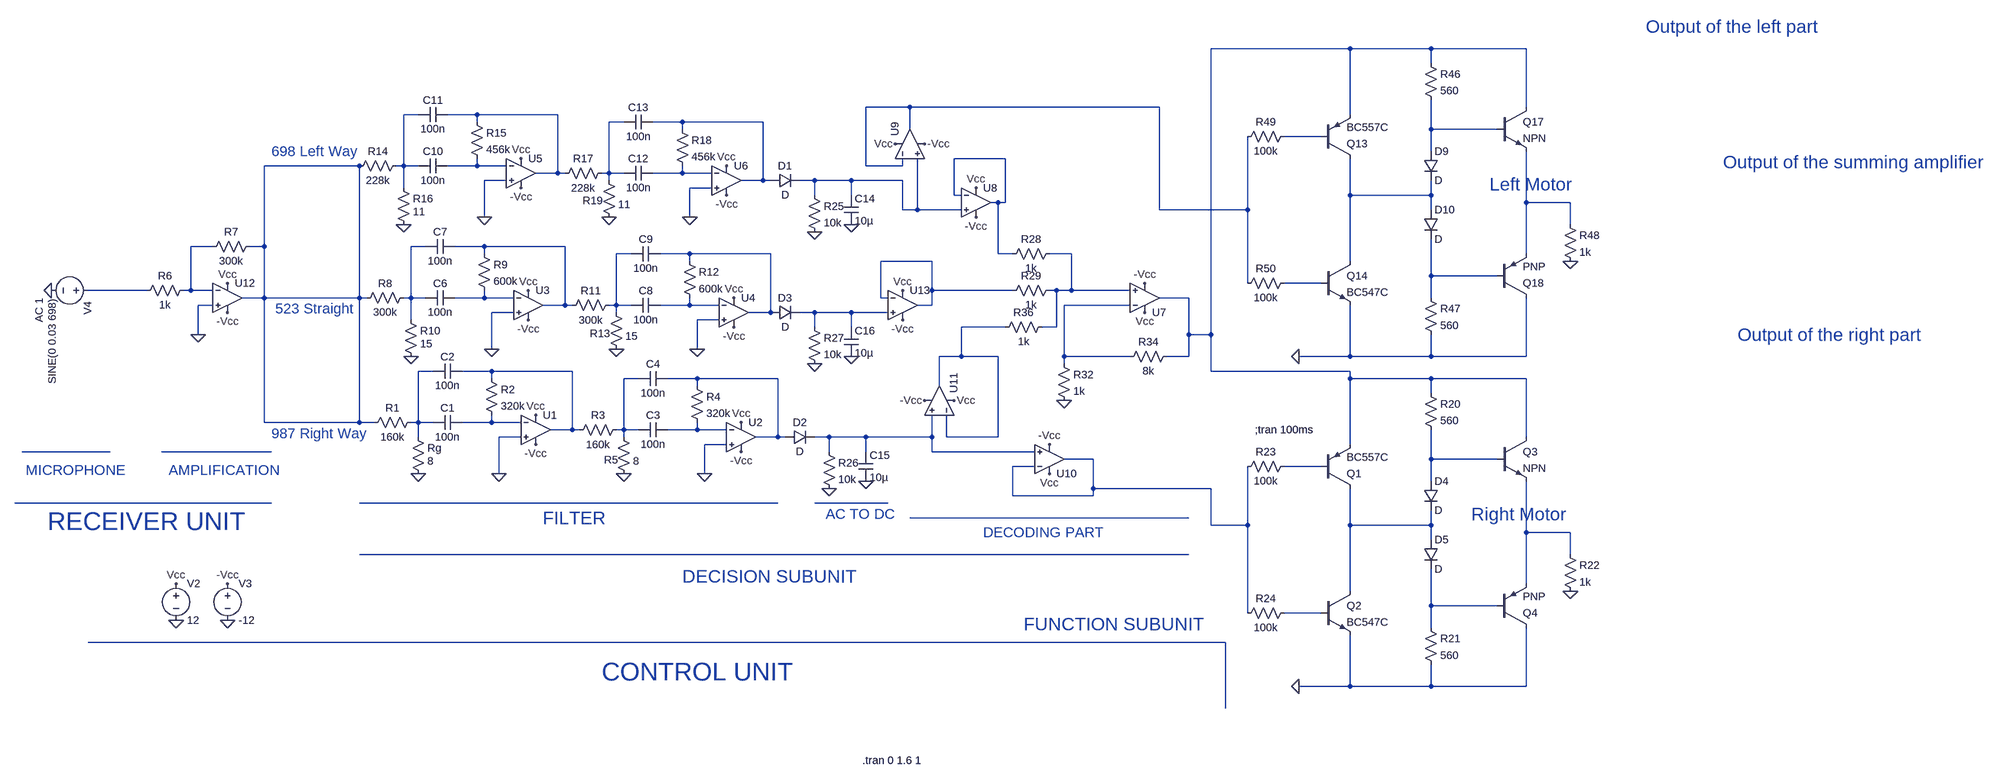
[diagram p0: schematic This-is-the-one.asc]
This-is-the-one.asc, the LTspice schematic file:
Version 4
SHEET 1 4472 1424
WIRE 704 -2160 400 -2160
WIRE 880 -2160 704 -2160
WIRE 1088 -2160 880 -2160
WIRE 880 -2128 880 -2160
WIRE -256 -2032 -352 -2032
WIRE 288 -2032 -256 -2032
WIRE 1088 -2032 1088 -2160
WIRE -1328 -2016 -1360 -2016
WIRE -1200 -2016 -1264 -2016
WIRE -1024 -2016 -1200 -2016
WIRE 704 -2016 704 -2160
WIRE -1200 -2000 -1200 -2016
WIRE -880 -2000 -912 -2000
WIRE -752 -2000 -816 -2000
WIRE -576 -2000 -752 -2000
WIRE -752 -1984 -752 -2000
WIRE -256 -1984 -256 -2032
WIRE 880 -1984 880 -2048
WIRE 1024 -1984 880 -1984
WIRE 640 -1968 560 -1968
WIRE 880 -1936 880 -1984
WIRE -48 -1920 -160 -1920
WIRE -1456 -1904 -1664 -1904
WIRE -1360 -1904 -1360 -2016
WIRE -1360 -1904 -1376 -1904
WIRE -1328 -1904 -1360 -1904
WIRE -1200 -1904 -1200 -1920
WIRE -1200 -1904 -1264 -1904
WIRE -1136 -1904 -1200 -1904
WIRE -352 -1904 -352 -2032
WIRE -272 -1904 -272 -1920
WIRE -272 -1904 -352 -1904
WIRE -1024 -1888 -1024 -2016
WIRE -1024 -1888 -1072 -1888
WIRE -1008 -1888 -1024 -1888
WIRE -912 -1888 -912 -2000
WIRE -912 -1888 -928 -1888
WIRE -880 -1888 -912 -1888
WIRE -752 -1888 -752 -1904
WIRE -752 -1888 -816 -1888
WIRE -688 -1888 -752 -1888
WIRE -1136 -1872 -1184 -1872
WIRE -912 -1872 -912 -1888
WIRE -576 -1872 -576 -2000
WIRE -576 -1872 -624 -1872
WIRE -560 -1872 -576 -1872
WIRE -464 -1872 -496 -1872
WIRE -384 -1872 -464 -1872
WIRE -272 -1872 -384 -1872
WIRE -1360 -1856 -1360 -1904
WIRE -688 -1856 -736 -1856
WIRE -464 -1840 -464 -1872
WIRE -384 -1840 -384 -1872
WIRE -160 -1840 -160 -1920
WIRE -144 -1840 -160 -1840
WIRE 704 -1840 704 -1920
WIRE 880 -1840 880 -1872
WIRE 880 -1840 704 -1840
WIRE -64 -1824 -80 -1824
WIRE -48 -1824 -48 -1920
WIRE -48 -1824 -64 -1824
WIRE 1088 -1824 1088 -1936
WIRE 1184 -1824 1088 -1824
WIRE -272 -1808 -272 -1872
WIRE -240 -1808 -240 -1920
WIRE -240 -1808 -272 -1808
WIRE -144 -1808 -240 -1808
WIRE 288 -1808 288 -2032
WIRE 480 -1808 480 -1968
WIRE 480 -1808 288 -1808
WIRE 880 -1808 880 -1840
WIRE -1184 -1792 -1184 -1872
WIRE -736 -1792 -736 -1856
WIRE 1184 -1776 1184 -1824
WIRE -1776 -1728 -1824 -1728
WIRE -1664 -1728 -1664 -1904
WIRE -1664 -1728 -1696 -1728
WIRE -1312 -1728 -1344 -1728
WIRE -1184 -1728 -1248 -1728
WIRE -1008 -1728 -1184 -1728
WIRE -1184 -1712 -1184 -1728
WIRE -864 -1712 -896 -1712
WIRE -736 -1712 -800 -1712
WIRE -560 -1712 -736 -1712
WIRE -64 -1712 -64 -1824
WIRE -32 -1712 -64 -1712
WIRE 96 -1712 48 -1712
WIRE 1088 -1712 1088 -1824
WIRE -736 -1696 -736 -1712
WIRE -208 -1696 -320 -1696
WIRE 704 -1696 704 -1840
WIRE 880 -1664 880 -1744
WIRE 1024 -1664 880 -1664
WIRE 480 -1648 480 -1808
WIRE 640 -1648 560 -1648
WIRE -1920 -1632 -2048 -1632
WIRE -1824 -1632 -1824 -1728
WIRE -1824 -1632 -1840 -1632
WIRE -1776 -1632 -1824 -1632
WIRE -208 -1632 -208 -1696
WIRE -32 -1632 -208 -1632
WIRE 64 -1632 48 -1632
WIRE 96 -1632 96 -1712
WIRE 96 -1632 64 -1632
WIRE 224 -1632 96 -1632
WIRE -1664 -1616 -1664 -1728
WIRE -1664 -1616 -1712 -1616
WIRE -1456 -1616 -1456 -1904
WIRE -1456 -1616 -1664 -1616
WIRE -1440 -1616 -1456 -1616
WIRE -1344 -1616 -1344 -1728
WIRE -1344 -1616 -1360 -1616
WIRE -1312 -1616 -1344 -1616
WIRE -1184 -1616 -1184 -1632
WIRE -1184 -1616 -1248 -1616
WIRE -1120 -1616 -1184 -1616
WIRE -320 -1616 -320 -1696
WIRE -304 -1616 -320 -1616
WIRE 352 -1616 288 -1616
WIRE 880 -1616 880 -1664
WIRE -1776 -1600 -1808 -1600
WIRE -1008 -1600 -1008 -1728
WIRE -1008 -1600 -1056 -1600
WIRE -992 -1600 -1008 -1600
WIRE -896 -1600 -896 -1712
WIRE -896 -1600 -912 -1600
WIRE -864 -1600 -896 -1600
WIRE -736 -1600 -736 -1616
WIRE -736 -1600 -800 -1600
WIRE -672 -1600 -736 -1600
WIRE -208 -1600 -208 -1632
WIRE -208 -1600 -240 -1600
WIRE 224 -1600 80 -1600
WIRE -1120 -1584 -1168 -1584
WIRE -896 -1584 -896 -1600
WIRE -560 -1584 -560 -1712
WIRE -560 -1584 -608 -1584
WIRE -544 -1584 -560 -1584
WIRE -464 -1584 -496 -1584
WIRE -384 -1584 -464 -1584
WIRE -304 -1584 -384 -1584
WIRE -1344 -1568 -1344 -1616
WIRE -672 -1568 -720 -1568
WIRE -464 -1552 -464 -1584
WIRE -384 -1552 -384 -1584
WIRE -48 -1552 -144 -1552
WIRE 64 -1552 64 -1632
WIRE 64 -1552 32 -1552
WIRE -1808 -1536 -1808 -1600
WIRE 352 -1536 352 -1616
WIRE 400 -1536 400 -2160
WIRE 400 -1536 352 -1536
WIRE -1168 -1504 -1168 -1584
WIRE -720 -1504 -720 -1568
WIRE -144 -1488 -144 -1552
WIRE -144 -1488 -192 -1488
WIRE -64 -1488 -144 -1488
WIRE 80 -1488 80 -1600
WIRE 224 -1488 80 -1488
WIRE 352 -1488 352 -1536
WIRE 352 -1488 304 -1488
WIRE 704 -1488 704 -1600
WIRE 704 -1488 592 -1488
WIRE 880 -1488 880 -1536
WIRE 880 -1488 704 -1488
WIRE 1088 -1488 1088 -1616
WIRE 1088 -1488 880 -1488
WIRE 80 -1472 80 -1488
WIRE -1296 -1456 -1328 -1456
WIRE -1168 -1456 -1232 -1456
WIRE -992 -1456 -1168 -1456
WIRE 400 -1456 400 -1536
WIRE 704 -1456 400 -1456
WIRE -1168 -1440 -1168 -1456
WIRE -848 -1440 -880 -1440
WIRE -720 -1440 -784 -1440
WIRE -544 -1440 -720 -1440
WIRE 704 -1440 704 -1456
WIRE 880 -1440 704 -1440
WIRE 1088 -1440 880 -1440
WIRE -720 -1424 -720 -1440
WIRE -192 -1424 -192 -1488
WIRE 880 -1408 880 -1440
WIRE -1664 -1344 -1664 -1616
WIRE -1456 -1344 -1456 -1616
WIRE -1456 -1344 -1664 -1344
WIRE -1424 -1344 -1456 -1344
WIRE -1328 -1344 -1328 -1456
WIRE -1328 -1344 -1344 -1344
WIRE -1296 -1344 -1328 -1344
WIRE -1168 -1344 -1168 -1360
WIRE -1168 -1344 -1232 -1344
WIRE -1104 -1344 -1168 -1344
WIRE -992 -1328 -992 -1456
WIRE -992 -1328 -1040 -1328
WIRE -976 -1328 -992 -1328
WIRE -880 -1328 -880 -1440
WIRE -880 -1328 -896 -1328
WIRE -848 -1328 -880 -1328
WIRE -720 -1328 -720 -1344
WIRE -720 -1328 -784 -1328
WIRE -656 -1328 -720 -1328
WIRE -1328 -1312 -1328 -1344
WIRE -1104 -1312 -1152 -1312
WIRE -880 -1312 -880 -1328
WIRE -544 -1312 -544 -1440
WIRE -544 -1312 -592 -1312
WIRE -528 -1312 -544 -1312
WIRE -432 -1312 -464 -1312
WIRE -352 -1312 -432 -1312
WIRE -208 -1312 -208 -1360
WIRE -208 -1312 -352 -1312
WIRE -176 -1312 -176 -1360
WIRE -64 -1312 -64 -1488
WIRE -64 -1312 -176 -1312
WIRE 1088 -1312 1088 -1440
WIRE -656 -1296 -704 -1296
WIRE 704 -1296 704 -1440
WIRE -2000 -1280 -2192 -1280
WIRE -1648 -1280 -1888 -1280
WIRE -432 -1280 -432 -1312
WIRE -352 -1280 -352 -1312
WIRE -208 -1280 -208 -1312
WIRE 16 -1280 -208 -1280
WIRE 144 -1264 80 -1264
WIRE 880 -1264 880 -1328
WIRE 1024 -1264 880 -1264
WIRE 16 -1248 -32 -1248
WIRE 640 -1248 560 -1248
WIRE -1152 -1232 -1152 -1312
WIRE -704 -1232 -704 -1296
WIRE 880 -1216 880 -1264
WIRE 144 -1200 144 -1264
WIRE 400 -1200 144 -1200
WIRE -32 -1184 -32 -1248
WIRE 144 -1184 144 -1200
WIRE 144 -1184 -32 -1184
WIRE -1648 -1168 -2208 -1168
WIRE -544 -1168 -1456 -1168
WIRE -304 -1168 -464 -1168
WIRE 352 -1136 -256 -1136
WIRE 400 -1120 400 -1200
WIRE 480 -1120 480 -1248
WIRE 480 -1120 400 -1120
WIRE 704 -1120 704 -1200
WIRE 880 -1120 880 -1152
WIRE 880 -1120 704 -1120
WIRE 1088 -1104 1088 -1216
WIRE 1184 -1104 1088 -1104
WIRE 880 -1088 880 -1120
WIRE 352 -1056 -1456 -1056
WIRE 1184 -1056 1184 -1104
WIRE 1088 -992 1088 -1104
WIRE 704 -976 704 -1120
WIRE 880 -944 880 -1024
WIRE 1024 -944 880 -944
WIRE 480 -928 480 -1120
WIRE 640 -928 560 -928
WIRE 880 -896 880 -944
WIRE 432 -864 -2048 -864
WIRE 704 -768 704 -880
WIRE 704 -768 592 -768
WIRE 880 -768 880 -816
WIRE 880 -768 704 -768
WIRE 1088 -768 1088 -896
WIRE 1088 -768 880 -768
WIRE 432 -720 432 -864
FLAG -1328 -1232 0
FLAG -2128 -1632 0
FLAG -1072 -1296 -Vcc
FLAG -1152 -1232 0
FLAG -880 -1232 0
FLAG -624 -1344 Vcc
FLAG -624 -1280 -Vcc
FLAG -704 -1232 0
FLAG -1344 -1488 0
FLAG -1088 -1632 Vcc
FLAG -1088 -1568 -Vcc
FLAG -1168 -1504 0
FLAG -896 -1504 0
FLAG -640 -1616 Vcc
FLAG -640 -1552 -Vcc
FLAG -720 -1504 0
FLAG -1360 -1776 0
FLAG -1104 -1920 Vcc
FLAG -1104 -1856 -Vcc
FLAG -1184 -1792 0
FLAG -912 -1792 0
FLAG -656 -1904 Vcc
FLAG -656 -1840 -Vcc
FLAG -736 -1792 0
FLAG -464 -1472 0
FLAG -384 -1488 0
FLAG -352 -1216 0
FLAG -432 -1200 0
FLAG -464 -1760 0
FLAG -384 -1776 0
FLAG -1808 -1536 0
FLAG -1744 -1584 -Vcc
FLAG -1072 -1360 Vcc
FLAG -1744 -1648 Vcc
FLAG -1856 -992 Vcc
FLAG -1744 -992 -Vcc
FLAG -1856 -912 0
FLAG -1744 -912 0
FLAG 1184 -1696 0
FLAG 1184 -976 0
FLAG 592 -1488 0
FLAG 592 -768 0
FLAG 256 -1584 Vcc
FLAG 256 -1648 -Vcc
FLAG -288 -1952 Vcc
FLAG -224 -1952 -Vcc
FLAG 48 -1232 Vcc
FLAG 48 -1296 -Vcc
FLAG 80 -1392 0
FLAG -112 -1856 Vcc
FLAG -112 -1792 -Vcc
FLAG -160 -1392 Vcc
FLAG -224 -1392 -Vcc
FLAG -272 -1632 Vcc
FLAG -272 -1568 -Vcc
SYMBOL res -1328 -1360 R90
WINDOW 0 0 56 VBottom 2
WINDOW 3 32 56 VTop 2
SYMATTR InstName R1
SYMATTR Value 160k
SYMBOL cap -1232 -1360 R90
WINDOW 0 0 32 VBottom 2
WINDOW 3 32 32 VTop 2
SYMATTR InstName C1
SYMATTR Value 100n
SYMBOL cap -1232 -1472 R90
WINDOW 0 0 32 VBottom 2
WINDOW 3 32 32 VTop 2
SYMATTR InstName C2
SYMATTR Value 100n
SYMBOL res -1184 -1456 R0
SYMATTR InstName R2
SYMATTR Value 320k
SYMBOL Opamps\\UniversalOpamp2 -1072 -1328 R0
SYMATTR InstName U1
SYMBOL res -1344 -1328 R0
WINDOW 3 36 68 Left 2
SYMATTR Value 8
SYMATTR InstName Rg
SYMBOL res -880 -1344 R90
WINDOW 0 0 56 VBottom 2
WINDOW 3 33 56 VTop 2
SYMATTR InstName R3
SYMATTR Value 160k
SYMBOL cap -784 -1344 R90
WINDOW 0 0 32 VBottom 2
WINDOW 3 32 32 VTop 2
SYMATTR InstName C3
SYMATTR Value 100n
SYMBOL cap -784 -1456 R90
WINDOW 0 0 32 VBottom 2
WINDOW 3 32 32 VTop 2
SYMATTR InstName C4
SYMATTR Value 100n
SYMBOL res -736 -1440 R0
SYMATTR InstName R4
SYMATTR Value 320k
SYMBOL Opamps\\UniversalOpamp2 -624 -1312 R0
SYMATTR InstName U2
SYMBOL res -896 -1328 R0
WINDOW 3 36 68 Left 2
WINDOW 0 -27 66 Left 2
SYMATTR Value 8
SYMATTR InstName R5
SYMBOL voltage -2032 -1632 R90
WINDOW 3 17 94 Left 2
WINDOW 123 17 122 Left 2
WINDOW 39 0 0 Left 2
SYMATTR Value SINE(0 0.03 698)
SYMATTR Value2 AC 1
SYMATTR InstName V4
SYMBOL res -1344 -1632 R90
WINDOW 0 0 56 VBottom 2
WINDOW 3 32 56 VTop 2
SYMATTR InstName R8
SYMATTR Value 300k
SYMBOL cap -1248 -1632 R90
WINDOW 0 0 32 VBottom 2
WINDOW 3 32 32 VTop 2
SYMATTR InstName C6
SYMATTR Value 100n
SYMBOL cap -1248 -1744 R90
WINDOW 0 0 32 VBottom 2
WINDOW 3 32 32 VTop 2
SYMATTR InstName C7
SYMATTR Value 100n
SYMBOL res -1200 -1728 R0
SYMATTR InstName R9
SYMATTR Value 600k
SYMBOL Opamps\\UniversalOpamp2 -1088 -1600 R0
SYMATTR InstName U3
SYMBOL res -1360 -1584 R0
WINDOW 3 36 68 Left 2
SYMATTR Value 15
SYMATTR InstName R10
SYMBOL res -896 -1616 R90
WINDOW 0 0 56 VBottom 2
WINDOW 3 33 56 VTop 2
SYMATTR InstName R11
SYMATTR Value 300k
SYMBOL cap -800 -1616 R90
WINDOW 0 0 32 VBottom 2
WINDOW 3 32 32 VTop 2
SYMATTR InstName C8
SYMATTR Value 100n
SYMBOL cap -800 -1728 R90
WINDOW 0 0 32 VBottom 2
WINDOW 3 32 32 VTop 2
SYMATTR InstName C9
SYMATTR Value 100n
SYMBOL res -752 -1712 R0
SYMATTR InstName R12
SYMATTR Value 600k
SYMBOL Opamps\\UniversalOpamp2 -640 -1584 R0
SYMATTR InstName U4
SYMBOL res -912 -1600 R0
WINDOW 3 36 68 Left 2
WINDOW 0 -42 62 Left 2
SYMATTR Value 15
SYMATTR InstName R13
SYMBOL res -1360 -1920 R90
WINDOW 0 0 56 VBottom 2
WINDOW 3 32 56 VTop 2
SYMATTR InstName R14
SYMATTR Value 228k
SYMBOL cap -1264 -1920 R90
WINDOW 0 0 32 VBottom 2
WINDOW 3 32 32 VTop 2
SYMATTR InstName C10
SYMATTR Value 100n
SYMBOL cap -1264 -2032 R90
WINDOW 0 0 32 VBottom 2
WINDOW 3 32 32 VTop 2
SYMATTR InstName C11
SYMATTR Value 100n
SYMBOL res -1216 -2016 R0
SYMATTR InstName R15
SYMATTR Value 456k
SYMBOL Opamps\\UniversalOpamp2 -1104 -1888 R0
SYMATTR InstName U5
SYMBOL res -1376 -1872 R0
WINDOW 3 36 68 Left 2
SYMATTR Value 11
SYMATTR InstName R16
SYMBOL res -912 -1904 R90
WINDOW 0 0 56 VBottom 2
WINDOW 3 33 56 VTop 2
SYMATTR InstName R17
SYMATTR Value 228k
SYMBOL cap -816 -1904 R90
WINDOW 0 0 32 VBottom 2
WINDOW 3 32 32 VTop 2
SYMATTR InstName C12
SYMATTR Value 100n
SYMBOL cap -816 -2016 R90
WINDOW 0 0 32 VBottom 2
WINDOW 3 32 32 VTop 2
SYMATTR InstName C13
SYMATTR Value 100n
SYMBOL res -768 -2000 R0
SYMATTR InstName R18
SYMATTR Value 456k
SYMBOL Opamps\\UniversalOpamp2 -656 -1872 R0
SYMATTR InstName U6
SYMBOL res -928 -1888 R0
WINDOW 3 36 68 Left 2
WINDOW 0 -42 60 Left 2
SYMATTR Value 11
SYMATTR InstName R19
SYMBOL diode -560 -1856 R270
WINDOW 0 32 32 VTop 2
WINDOW 3 0 32 VBottom 2
SYMATTR InstName D1
SYMBOL diode -528 -1296 R270
WINDOW 0 32 32 VTop 2
WINDOW 3 0 32 VBottom 2
SYMATTR InstName D2
SYMBOL diode -560 -1568 R270
WINDOW 0 32 32 VTop 2
WINDOW 3 0 32 VBottom 2
SYMATTR InstName D3
SYMBOL res -480 -1856 R0
SYMATTR InstName R25
SYMATTR Value 10k
SYMBOL res -448 -1296 R0
SYMATTR InstName R26
SYMATTR Value 10k
SYMBOL res -480 -1568 R0
SYMATTR InstName R27
SYMATTR Value 10k
SYMBOL cap -400 -1840 R0
SYMATTR InstName C14
SYMATTR Value 10µ
SYMBOL cap -368 -1280 R0
SYMATTR InstName C15
SYMATTR Value 10µ
SYMBOL cap -400 -1552 R0
SYMATTR InstName C16
SYMATTR Value 10µ
SYMBOL Opamps\\UniversalOpamp2 -1744 -1616 R0
SYMATTR InstName U12
SYMBOL res -1824 -1648 R90
WINDOW 0 0 56 VBottom 2
WINDOW 3 32 56 VTop 2
SYMATTR InstName R6
SYMATTR Value 1k
SYMBOL res -1680 -1744 R90
WINDOW 0 0 56 VBottom 2
WINDOW 3 32 56 VTop 2
SYMATTR InstName R7
SYMATTR Value 300k
SYMBOL voltage -1856 -1008 R0
WINDOW 123 0 0 Left 2
WINDOW 39 0 0 Left 2
SYMATTR InstName V2
SYMATTR Value 12
SYMBOL voltage -1744 -1008 R0
WINDOW 123 0 0 Left 2
WINDOW 39 0 0 Left 2
SYMATTR InstName V3
SYMATTR Value -12
SYMBOL pnp 640 -1920 M180
SYMATTR InstName Q13
SYMATTR Value BC557C
SYMBOL npn 640 -1696 R0
SYMATTR InstName Q14
SYMATTR Value BC547C
SYMBOL npn 1024 -2032 R0
SYMATTR InstName Q17
SYMBOL pnp 1024 -1616 M180
SYMATTR InstName Q18
SYMBOL res 864 -2144 R0
SYMATTR InstName R46
SYMATTR Value 560
SYMBOL res 864 -1632 R0
SYMATTR InstName R47
SYMATTR Value 560
SYMBOL diode 864 -1936 R0
SYMATTR InstName D9
SYMBOL diode 864 -1808 R0
SYMATTR InstName D10
SYMBOL res 1168 -1792 R0
SYMATTR InstName R48
SYMATTR Value 1k
SYMBOL res 576 -1984 R90
WINDOW 0 0 56 VBottom 2
WINDOW 3 32 56 VTop 2
SYMATTR InstName R49
SYMATTR Value 100k
SYMBOL res 576 -1664 R90
WINDOW 0 0 56 VBottom 2
WINDOW 3 32 56 VTop 2
SYMATTR InstName R50
SYMATTR Value 100k
SYMBOL pnp 640 -1200 M180
SYMATTR InstName Q1
SYMATTR Value BC557C
SYMBOL npn 640 -976 R0
SYMATTR InstName Q2
SYMATTR Value BC547C
SYMBOL npn 1024 -1312 R0
SYMATTR InstName Q3
SYMBOL pnp 1024 -896 M180
SYMATTR InstName Q4
SYMBOL res 864 -1424 R0
SYMATTR InstName R20
SYMATTR Value 560
SYMBOL res 864 -912 R0
SYMATTR InstName R21
SYMATTR Value 560
SYMBOL diode 864 -1216 R0
SYMATTR InstName D4
SYMBOL diode 864 -1088 R0
SYMATTR InstName D5
SYMBOL res 1168 -1072 R0
SYMATTR InstName R22
SYMATTR Value 1k
SYMBOL res 576 -1264 R90
WINDOW 0 0 56 VBottom 2
WINDOW 3 32 56 VTop 2
SYMATTR InstName R23
SYMATTR Value 100k
SYMBOL res 576 -944 R90
WINDOW 0 0 56 VBottom 2
WINDOW 3 32 56 VTop 2
SYMATTR InstName R24
SYMATTR Value 100k
SYMBOL Opamps\\UniversalOpamp2 256 -1616 M180
SYMATTR InstName U7
SYMBOL res 64 -1728 R90
WINDOW 0 0 56 VBottom 2
WINDOW 3 32 56 VTop 2
SYMATTR InstName R28
SYMATTR Value 1k
SYMBOL res 64 -1648 R90
WINDOW 0 0 56 VBottom 2
WINDOW 3 32 56 VTop 2
SYMATTR InstName R29
SYMATTR Value 1k
SYMBOL Opamps\\UniversalOpamp2 -256 -1952 R270
SYMATTR InstName U9
SYMBOL Opamps\\UniversalOpamp2 48 -1264 M180
SYMATTR InstName U10
SYMBOL res 64 -1488 R0
SYMATTR InstName R32
SYMATTR Value 1k
SYMBOL res 320 -1504 R90
WINDOW 0 0 56 VBottom 2
WINDOW 3 32 56 VTop 2
SYMATTR InstName R34
SYMATTR Value 8k
SYMBOL res 48 -1568 R90
WINDOW 0 0 56 VBottom 2
WINDOW 3 32 56 VTop 2
SYMATTR InstName R36
SYMATTR Value 1k
SYMBOL Opamps\\UniversalOpamp2 -112 -1824 R0
SYMATTR InstName U8
SYMBOL Opamps\\UniversalOpamp2 -192 -1392 M270
SYMATTR InstName U11
SYMBOL Opamps\\UniversalOpamp2 -272 -1600 R0
SYMATTR InstName U13
TEXT -1648 -1936 Left 3 ;698 Left Way
TEXT -1640 -1592 Left 3 ;523 Straight
TEXT -1648 -1320 Left 3 ;987 Right Way
TEXT -360 552 Left 2 !.tran 0 1.6 1
TEXT 496 -1328 Left 2 !;tran 100ms
TEXT 1008 -1864 Left 4 ;Left Motor
TEXT 968 -1144 Left 4 ;Right Motor
TEXT 2384 -2208 Left 4 ;Output of the left part
TEXT 2552 -1912 Left 4 ;Output of the summing amplifier
TEXT 2584 -1536 Left 4 ;Output of the right part
TEXT -1056 -1136 Left 4 ;FILTER
TEXT -1872 -1240 Left 3 ;AMPLIFICATION
TEXT -2184 -1240 Left 3 ;MICROPHONE
TEXT -2136 -1128 Left 5 ;RECEIVER UNIT
TEXT -440 -1144 Left 3 ;AC TO DC
TEXT -96 -1104 Left 3 ;DECODING PART
TEXT -752 -1008 Left 4 ;DECISION SUBUNIT
TEXT -8 -904 Left 4 ;FUNCTION SUBUNIT
TEXT -928 -800 Left 5 ;CONTROL UNIT

The netlist it stands for:
* This-is-the-one.asc
R1 N031 N010 160k
C1 N035 N031 100n
C2 N032 N031 100n
R2 N032 N035 320k
XU1 0 N035 Vcc -Vcc N032 level.2 Avol=1Meg GBW=10Meg Slew=10Meg ilimit=25m rail=0 Vos=0 phimargin=45 en=0 enk=0 in=0 ink=0 Rin=500Meg  ; pins IN+ IN- V+ V- OUT
Rg N031 0 8
R3 N033 N032 160k
C3 N036 N033 100n
C4 N034 N033 100n
R4 N034 N036 320k
XU2 0 N036 Vcc -Vcc N034 level.2 Avol=1Meg GBW=10Meg Slew=10Meg ilimit=25m rail=0 Vos=0 phimargin=45 en=0 enk=0 in=0 ink=0 Rin=500Meg  ; pins IN+ IN- V+ V- OUT
R5 N033 0 8
V4 N025 0 SINE(0 0.03 698) AC 1
R8 N017 N010 300k
C6 N026 N017 100n
C7 N018 N017 100n
R9 N018 N026 600k
XU3 0 N026 Vcc -Vcc N018 level.2 Avol=1Meg GBW=10Meg Slew=10Meg ilimit=25m rail=0 Vos=0 phimargin=45 en=0 enk=0 in=0 ink=0 Rin=500Meg  ; pins IN+ IN- V+ V- OUT
R10 N017 0 15
R11 N019 N018 300k
C8 N027 N019 100n
C9 N020 N019 100n
R12 N020 N027 600k
XU4 0 N027 Vcc -Vcc N020 level.2 Avol=1Meg GBW=10Meg Slew=10Meg ilimit=25m rail=0 Vos=0 phimargin=45 en=0 enk=0 in=0 ink=0 Rin=500Meg  ; pins IN+ IN- V+ V- OUT
R13 N019 0 15
R14 N003 N010 228k
C10 N011 N003 100n
C11 N004 N003 100n
R15 N004 N011 456k
XU5 0 N011 Vcc -Vcc N004 level.2 Avol=1Meg GBW=10Meg Slew=10Meg ilimit=25m rail=0 Vos=0 phimargin=45 en=0 enk=0 in=0 ink=0 Rin=500Meg  ; pins IN+ IN- V+ V- OUT
R16 N003 0 11
R17 N005 N004 228k
C12 N012 N005 100n
C13 N006 N005 100n
R18 N006 N012 456k
XU6 0 N012 Vcc -Vcc N006 level.2 Avol=1Meg GBW=10Meg Slew=10Meg ilimit=25m rail=0 Vos=0 phimargin=45 en=0 enk=0 in=0 ink=0 Rin=500Meg  ; pins IN+ IN- V+ V- OUT
R19 N005 0 11
D1 N006 N013 D
D2 N034 N037 D
D3 N020 N029 D
R25 N013 0 10k
R26 N037 0 10k
R27 N029 0 10k
C14 N013 0 10µ
C15 N037 0 10µ
C16 N029 0 10µ
XU12 0 N016 Vcc -Vcc N010 level.2 Avol=1Meg GBW=10Meg Slew=10Meg ilimit=25m rail=0 Vos=0 phimargin=45 en=0 enk=0 in=0 ink=0 Rin=500Meg  ; pins IN+ IN- V+ V- OUT
R6 N016 N025 1k
R7 N010 N016 300k
V2 Vcc 0 12
V3 -Vcc 0 -12
Q13 N014 N008 N001 0 BC557C
Q14 N014 N024 0 0 BC547C
Q17 N001 N007 N015 0 NPN
Q18 0 N023 N015 0 PNP
R46 N001 N007 560
R47 N023 0 560
D9 N007 N014 D
D10 N014 N023 D
R48 N015 0 1k
R49 N008 N002 100k
R50 N024 N002 100k
Q1 N047 N042 N001 0 BC557C
Q2 N047 N051 0 0 BC547C
Q3 N001 N041 N048 0 NPN
Q4 0 N050 N048 0 PNP
R20 N001 N041 560
R21 N050 0 560
D4 N041 N047 D
D5 N047 N050 D
R22 N048 0 1k
R23 N042 N040 100k
R24 N051 N040 100k
XU7 N021 N028 Vcc -Vcc N001 level.2 Avol=1Meg GBW=10Meg Slew=10Meg ilimit=25m rail=0 Vos=0 phimargin=45 en=0 enk=0 in=0 ink=0 Rin=500Meg  ; pins IN+ IN- V+ V- OUT
R28 N021 N009 1k
R29 N021 N022 1k
XU9 N013 N002 Vcc -Vcc N002 level.2 Avol=1Meg GBW=10Meg Slew=10Meg ilimit=25m rail=0 Vos=0 phimargin=45 en=0 enk=0 in=0 ink=0 Rin=500Meg  ; pins IN+ IN- V+ V- OUT
XU10 N037 N040 Vcc -Vcc N040 level.2 Avol=1Meg GBW=10Meg Slew=10Meg ilimit=25m rail=0 Vos=0 phimargin=45 en=0 enk=0 in=0 ink=0 Rin=500Meg  ; pins IN+ IN- V+ V- OUT
R32 N028 0 1k
R34 N001 N028 8k
R36 N021 N030 1k
XU8 N013 N009 Vcc -Vcc N009 level.2 Avol=1Meg GBW=10Meg Slew=10Meg ilimit=25m rail=0 Vos=0 phimargin=45 en=0 enk=0 in=0 ink=0 Rin=500Meg  ; pins IN+ IN- V+ V- OUT
XU11 N037 N030 Vcc -Vcc N030 level.2 Avol=1Meg GBW=10Meg Slew=10Meg ilimit=25m rail=0 Vos=0 phimargin=45 en=0 enk=0 in=0 ink=0 Rin=500Meg  ; pins IN+ IN- V+ V- OUT
XU13 N029 N022 Vcc -Vcc N022 level.2 Avol=1Meg GBW=10Meg Slew=10Meg ilimit=25m rail=0 Vos=0 phimargin=45 en=0 enk=0 in=0 ink=0 Rin=500Meg  ; pins IN+ IN- V+ V- OUT
.model D D
.lib standard.dio
.model NPN NPN
.model PNP PNP
.lib standard.bjt
* 698 Left Way
* 523 Straight
* 987 Right Way
.tran 0 1.6 1
;tran 100ms
* Left Motor
* Right Motor
* Output of the left part
* Output of the summing amplifier
* Output of the right part
* FILTER
* AMPLIFICATION
* MICROPHONE
* RECEIVER UNIT
* AC TO DC
* DECODING PART
* DECISION SUBUNIT
* FUNCTION SUBUNIT
* CONTROL UNIT
.lib UniversalOpamps2.sub
.backanno
.end